# EAGLE design regulation-level-shifter-mk-1.1 (EAGLE 6.5.0)
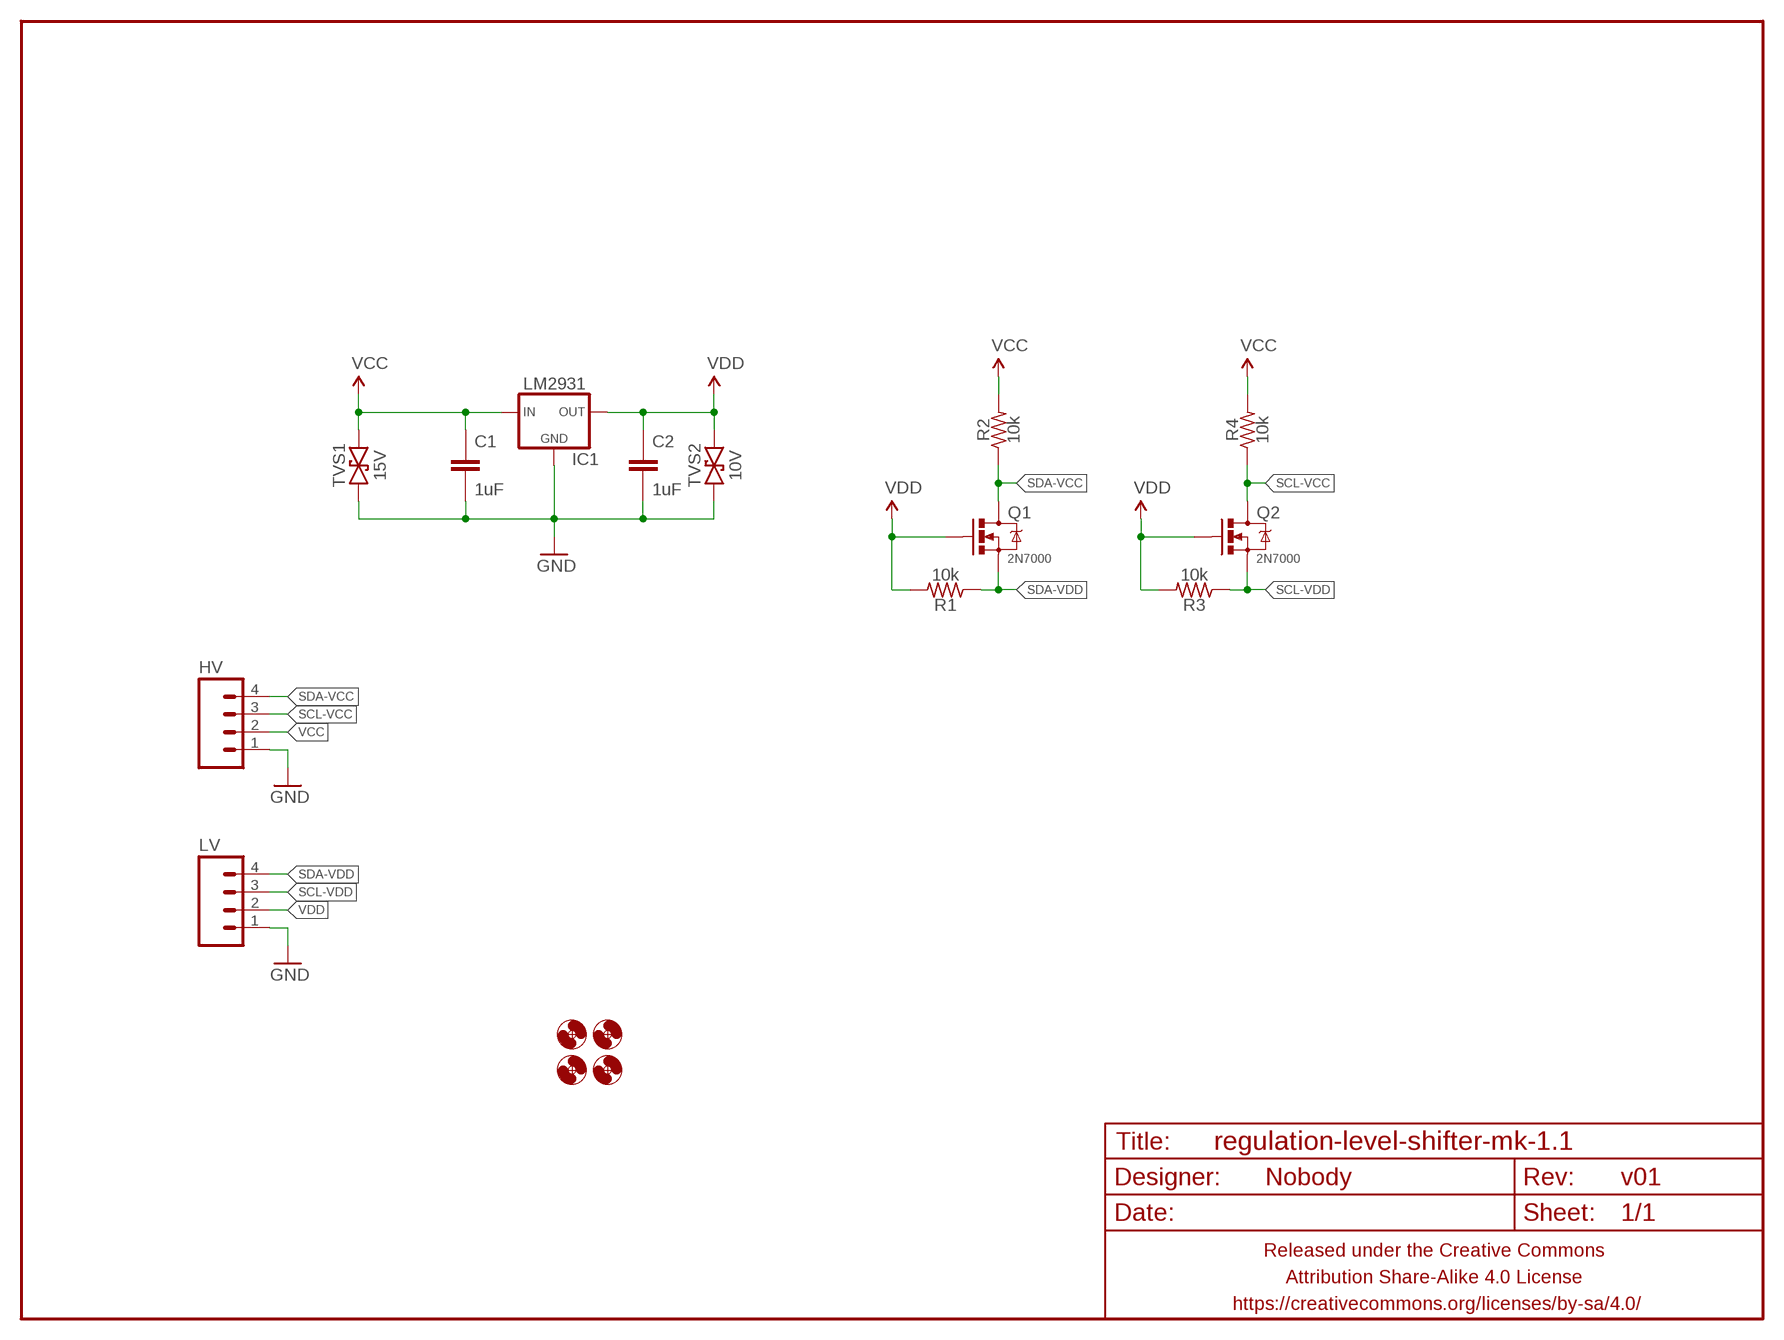
[diagram p0: schematic, sheet 1]

## Parts
C1  1uF  CAPACITOR-CERAMIC025-024X044  [C025-024X044]
C2  1uF  CAPACITOR-CERAMIC025-024X044  [C025-024X044]
FRAME1  FRAME-LETTERNO_PACKAGE  [DUMMY]
H1  HOLE#2  [HOLE-#2]
H2  HOLE#2  [HOLE-#2]
H3  HOLE#2  [HOLE-#2]
H4  HOLE#2  [HOLE-#2]
HV  M04PTH  [1X04-PTH-VERT]
IC1  LM2931  V_REG_78XXTO-92-INLINE  [TO-92-AMMO]
LV  M04PTH  [1X04-PTH-VERT]
Q1  2N7000  MOSFET-NCHANNEL2N7000-AMMO  [TO-92-AMMO]
Q2  2N7000  MOSFET-NCHANNEL2N7000-AMMO  [TO-92-AMMO]
R1  10k  RESISTORPTH-AXIAL-5.08MM  [RESISTOR-AXIAL-PTH-5.08MM]
R2  10k  RESISTORPTH-AXIAL-5.08MM  [RESISTOR-AXIAL-PTH-5.08MM]
R3  10k  RESISTORPTH-AXIAL-5.08MM  [RESISTOR-AXIAL-PTH-5.08MM]
R4  10k  RESISTORPTH-AXIAL-5.08MM  [RESISTOR-AXIAL-PTH-5.08MM]
TVS1  15V  TVSDO-41-10.16MM  [DO-41-TVS-BI-10.16MM]
TVS2  10V  TVSDO-41-10.16MM  [DO-41-TVS-BI-10.16MM]

## Nets
GND: C1.2 C2.2 HV.1 IC1.2(GND) LV.1 TVS1.P$1 TVS2.P$1
SCL-VCC: HV.3 Q2.3(D) R4.P$1
SCL-VDD: LV.3 Q2.1(S) R3.P$1
SDA-VCC: HV.4 Q1.3(D) R2.P$1
SDA-VDD: LV.4 Q1.1(S) R1.P$1
VCC: C1.1 HV.2 IC1.1(IN) R2.P$2 R4.P$2 TVS1.P$2
VDD: C2.1 IC1.3(OUT) LV.2 Q1.2(G) Q2.2(G) R1.P$2 R3.P$2 TVS2.P$2

## Library data of the parts
C1 C2 = A_butts:CAPACITOR-CERAMIC: CAPACITOR, European symbol
FRAME1 = A_butts:FRAME-LETTER: Schematic Frame Standard 8.5x11 US Letter frame; DESIGNER: Nobody; VERSION: v01
H1-H4 = A_butts:HOLE: MOUNTING HOLE with drill center marker
HV LV = A_butts:M04: Header 4 Standard 4-pin 0.1" header. Use with straight break away headers (SKU : PRT-00116), right angle break away headers (PRT-00553), swiss pins (PRT-00743), machine pins (PRT-00117), and female headers (PRT-00115). Molex polarized connector foot print use with SKU : PRT-08231 with associated crimp pins and housings. 1MM SMD Version SKU: PRT-10208
IC1 = A_butts:V_REG_78XX: Voltage Regulator Standard 7805 5V regulator. IGO (Input Ground Output). Spark Fun Electronics SKU : COM-00107
Q1 Q2 = A_butts:MOSFET-NCHANNEL: Common NMOSFET Parts MFG P/N Store ID Prod ID FDD8780 TRANS-09984 SI7820DN TRANS-11055 FDS6630A IC-08089 2N7002PW TRANS-11151 FQP30N06L COM-10213 TRANS-10060 BSS123LT1G TRANS-08345 BSS138 TRANS-00830 BS170 2N7000
R1-R4 = A_butts:RESISTOR: RESISTOR, American symbol
TVS1 TVS2 = A_butts:TVS: Transient voltage suppressor- prevents ESD on inputs. Ignore package description- MBRA140 is NOT this type of part!!!

## Board
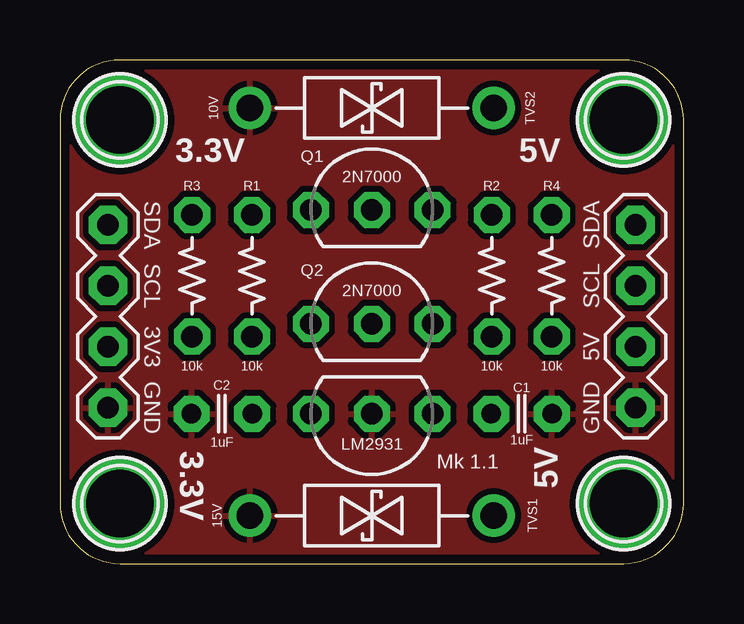
[diagram p1: board, top side]
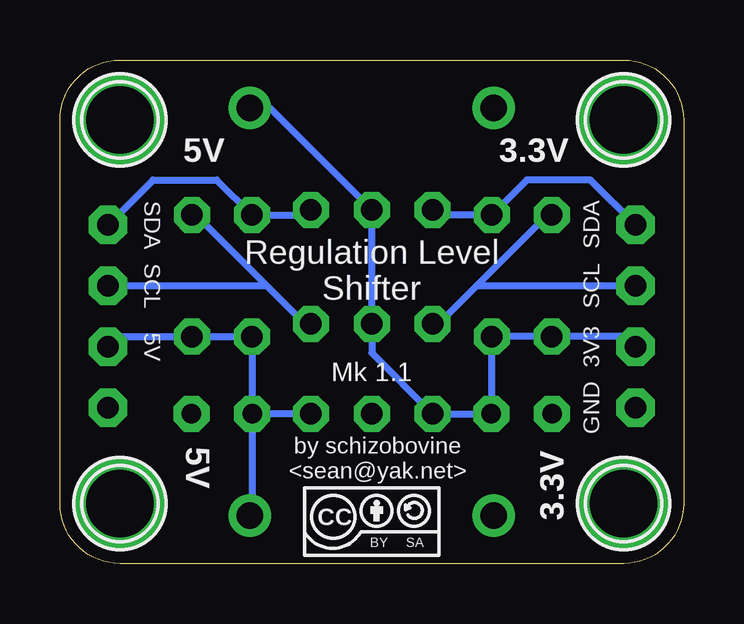
[diagram p2: board, bottom side, seen from below]

Size 26 x 21 mm. Coordinates in mm from the lower left corner, seen from the top.
Outline: 0,18.5 0,2.5 arc90 2.5,0 23.5,0 arc90 26,2.5 26,18.5 arc90 23.5,21 2.5,21 arc90 0,18.5
Copper layers (1*16): Top 0.0356mm / dielectric 1.5011mm / Bottom 0.0356mm
Design rules "LaenPCBOrder_2": minimum track width 6mil, minimum drill 13mil, track to track 6mil, track to pad 6mil, pad to pad 6mil, via to via 6mil, smd to smd 6mil, copper to edge 15mil, drill to drill 6mil, minimum pad ring 7mil, minimum via ring 7mil, stop-mask expansion 3mil, vias tented up to drill 20mil, thermal gap 10mil

### Footprints (pad centres in the part's own frame; a part is rotated, then mirrored left to right if it is on the bottom)
C025-024X044 = drill 0.813 pad 1.5 octagon: 1 -1.27,0; 2 1.27,0
HOLE-#2 = drill 2.8 pad 3.81: P$1 0,0
1X04-PTH-VERT = drill 0.9 pad 1.6 octagon: 1 0,0; 2 2.54,0; 3 5.08,0; 4 7.62,0
TO-92-AMMO = drill 0.9 pad 1.5 octagon: 1 -2.54,0; 2 0,0; 3 2.54,0
RESISTOR-AXIAL-PTH-5.08MM = drill 0.9 pad 1.5 octagon: P$1 -2.54,0; P$2 2.54,0
DO-41-TVS-BI-10.16MM = drill 1.1 pad 1.778: P$1 -5.08,0; P$2 5.08,0

### Placement (x,y rotation side)
C1  19.25,6.25 0 top
C2  6.75,6.25 180 top
FRAME1  0,0 0 top
H1  2.5,2.5 0 top
H2  23.5,2.5 0 top
H3  2.5,18.5 0 top
H4  23.5,18.5 0 top
HV  24,6.5 90 top
IC1  13,6.25 180 top
LV  2,6.5 90 top
Q1  13,14.75 0 top
Q2  13,10 0 top
R1  8,12 270 top
R2  18,12 270 top
R3  5.5,12 270 top
R4  20.5,12 270 top
TVS1  13,2 0 top
TVS2  13,19 0 top
U$1  [CC-BY-SA-4.0-NO-URL]  13,1.75 0 bottom

### Tracks (layer width: path | path; a pad name or v marks a point on that pad's centre or on a via)
GND
  pour Top (isolate 0.25): 23.5,0 2.5,0 arc-90 0,2.5 0,18.5 arc-90 2.5,21 23.5,21 arc-90 26,18.5 26,2.5 arc-90
SCL-VCC
  Bottom 0.3: 17.37,11.58 HV.3 | 17.37,11.58 20.33,14.54 R4.P$1 | Q2.3 15.79,10 17.37,11.58
SCL-VDD
  Bottom 0.3: LV.3 8.63,11.58 | 8.63,11.58 5.67,14.54 R3.P$1 | 8.63,11.58 10.21,10 Q2.1
SDA-VCC
  Bottom 0.3: HV.4 22.12,16 19.46,16 R2.P$1 15.75,14.54 Q1.3
SDA-VDD
  Bottom 0.3: LV.4 3.88,16 6.54,16 R1.P$1 10.25,14.54 Q1.1
VCC
  Bottom 0.3: HV.2 23.58,9.46 R4.P$2 R2.P$2 18,6.27 C1.1 | IC1.1 C1.1 | C1.1 17.98,2.1 TVS1.P$2
VDD
  Bottom 0.3: LV.2 2.42,9.46 R3.P$2 R1.P$2 8,6.27 C2.1 IC1.3 13,8.79 Q2.2 Q1.2 17.25,19 TVS2.P$2

### Text on the board
bPlace: Regulation Level / Shifter | by schizobovine / <sean@yak.net>
tNames: 3.3V | 5V | SDA | SDA | SCL | SCL | 3V3 | 5V | GND | GND | 5V | 3.3V
bNames: 3.3V | 5V | SDA | SDA | SCL | SCL | 3V3 | 5V | GND | 5V | 3.3V